# Altium project PowerBoardV2_Logic.PrjPcb
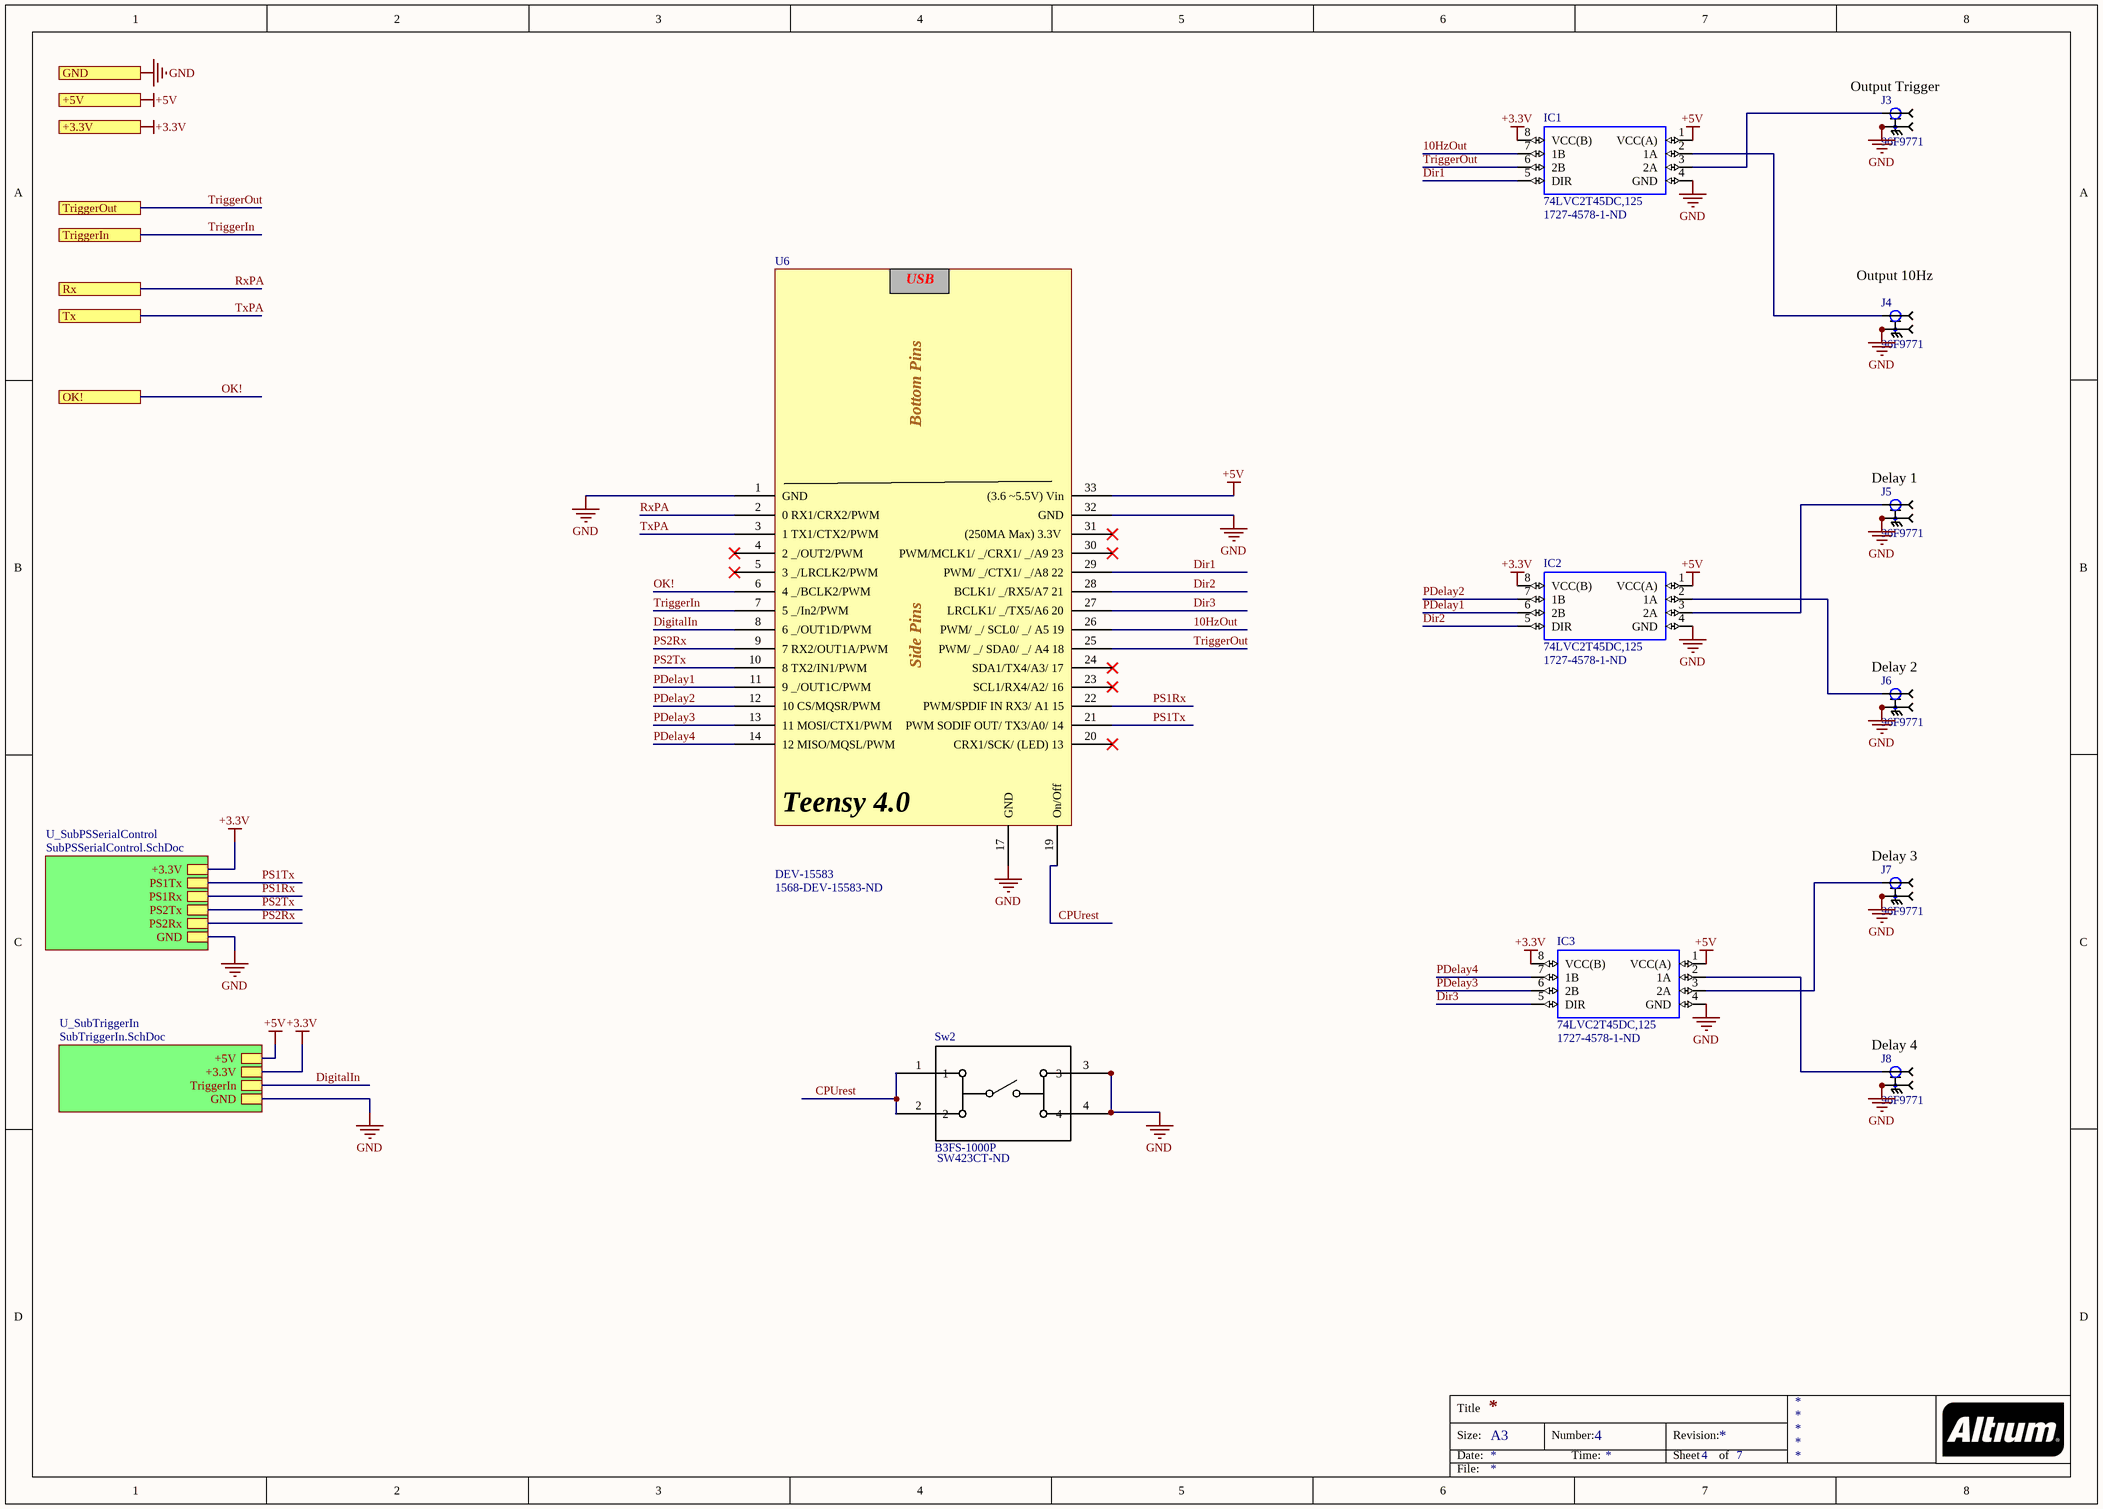
[diagram p0: PAsignal Genrator.SchDoc]
4 sheets, 112 parts. Net scope: hierarchical (ports join the sheet entries above them; power ports are global).
Board file: PCUgen2.PcbDoc
Sheets:
  PAsignal Genrator.SchDoc
    U_SubPSSerialControl = SubPSSerialControl.SchDoc
  SubCardConnect.SchDoc
  SubSchHVCotrol.SchDoc

## Sheet PAsignal Genrator.SchDoc
size A3; DocumentNumber: 4; SheetNumber: 4; SheetTotal: 7

### Parts
IC1  74LVC2T45DC,125  Supplier Part Number 1: 1727-4578-1-ND  [SOP50P310X100-8N]
IC2  74LVC2T45DC,125  Supplier Part Number 1: 1727-4578-1-ND  [SOP50P310X100-8N]
IC3  74LVC2T45DC,125  Supplier Part Number 1: 1727-4578-1-ND  [SOP50P310X100-8N]
J3  Supplier Part Number 1: 96F9771  [SMBboardEdge]  (hidden comment: 131-3701-801)
J4  Supplier Part Number 1: 96F9771  [SMBboardEdge]  (hidden comment: 131-3701-801)
J5  Supplier Part Number 1: 96F9771  [SMBboardEdge]  (hidden comment: 131-3701-801)
J6  Supplier Part Number 1: 96F9771  [SMBboardEdge]  (hidden comment: 131-3701-801)
J7  Supplier Part Number 1: 96F9771  [SMBboardEdge]  (hidden comment: 131-3701-801)
J8  Supplier Part Number 1: 96F9771  [SMBboardEdge]  (hidden comment: 131-3701-801)
Sw2  B3FS-1000P  Supplier Part Number 1: SW423CT-ND  [B3FS-1000P]
U6  DEV-15583  Supplier Part Number 1: 1568-DEV-15583-ND  [Teensy 4.0sideOnly]

### Sub-sheets
U_SubPSSerialControl = SubPSSerialControl.SchDoc: +3.3V, PS1Tx, PS1Rx, PS2Tx, PS2Rx, GND
U_SubTriggerIn = SubTriggerIn.SchDoc (file not in this document): +5V, GND, +3.3V, TriggerIn

### Ports
+3.3V, +5V, GND, OK!, Rx, TriggerIn, TriggerOut, Tx

### Nets
+3.3V: IC1.8(VCC(B)) IC2.8(VCC(B)) IC3.8(VCC(B)) ; port +3.3V, sheet U_SubPSSerialControl/+3.3V, sheet U_SubTriggerIn/+3.3V
+5V: IC1.1(VCC(A)) IC2.1(VCC(A)) IC3.1(VCC(A)) U6.33((3.6_~5.5V)_Vin) ; port +5V, sheet U_SubTriggerIn/+5V
GND: IC1.4(GND) IC2.4(GND) IC3.4(GND) J3.SH1 J3.SH2 J3.SH3 J3.SH4 J4.SH1 J4.SH2 J4.SH3 J4.SH4 J5.SH1 J5.SH2 J5.SH3 J5.SH4 J6.SH1 J6.SH2 J6.SH3 J6.SH4 J7.SH1 J7.SH2 J7.SH3 J7.SH4 J8.SH1 J8.SH2 J8.SH3 J8.SH4 Sw2.3 Sw2.4 U6.1(GND) U6.17(GND) U6.32(GND) ; port GND, sheet U_SubPSSerialControl/GND, sheet U_SubTriggerIn/GND
10HzOut: IC1.7(1B) U6.26(PWM/__/_SCL0/__/_A5_19)
CPUrest: Sw2.1 Sw2.2 U6.19(On/Off)
DigitalIn: U6.8(6__/OUT1D/PWM) ; sheet U_SubTriggerIn/TriggerIn
Dir1: IC1.5(DIR) U6.29(PWM/__/CTX1/__/A8_22)
Dir2: IC2.5(DIR) U6.28(BCLK1/__/RX5/A7_21)
Dir3: IC3.5(DIR) U6.27(LRCLK1/__/TX5/A6_20)
OK!: U6.6(4__/BCLK2/PWM) ; port OK!
PDelay1: IC2.6(2B) U6.11(9__/OUT1C/PWM)
PDelay2: IC2.7(1B) U6.12(10_CS/MQSR/PWM)
PDelay3: IC3.6(2B) U6.13(11_MOSI/CTX1/PWM)
PDelay4: IC3.7(1B) U6.14(12_MISO/MQSL/PWM)
PS1Rx: U6.22(PWM/SPDIF_IN_RX3/_A1_15) ; sheet U_SubPSSerialControl/PS1Rx
PS1Tx: U6.21(PWM_SODIF_OUT/_TX3/A0/_14) ; sheet U_SubPSSerialControl/PS1Tx
PS2Rx: U6.9(7_RX2/OUT1A/PWM) ; sheet U_SubPSSerialControl/PS2Rx
PS2Tx: U6.10(8_TX2/IN1/PWM) ; sheet U_SubPSSerialControl/PS2Tx
RxPA: U6.2(0_RX1/CRX2/PWM) ; port Rx
TriggerIn: U6.7(5__/In2/PWM) ; port TriggerIn
TriggerOut: IC1.6(2B) U6.25(PWM/__/_SDA0/__/_A4_18) ; port TriggerOut
TxPA: U6.3(1_TX1/CTX2/PWM) ; port Tx
NetIC1_2: IC1.2(1A) J4.1
NetIC1_3: IC1.3(2A) J3.1
NetIC2_2: IC2.2(1A) J6.1
NetIC2_3: IC2.3(2A) J5.1
NetIC3_2: IC3.2(1A) J8.1
NetIC3_3: IC3.3(2A) J7.1

Not connected (* = marked no-connect by the designer): U6 4(2__/OUT2/PWM)* 5(3__/LRCLK2/PWM)* 20(CRX1/SCK/_(LED)_13)* 23(SCL1/RX4/A2/_16)* 24(SDA1/TX4/A3/_17)* 30(PWM/MCLK1/__/CRX1/__/A9_23)* 31((250MA_Max)_3.3V_)*

### Notes on the sheet
- (near J3) Output Trigger
- (near J4) Output 10Hz
- (near J5) Delay 1
- (near J6) Delay 2
- (near J7) Delay 3
- (near J8) Delay 4
- Title
- Size:
- Date:
- A3
- Number:
- Time:
- Revision:
- Sheet
- of
- File:
- (in symbol Teensy 4.0_SideOnly) USB; Bottom Pins; Side Pins; Teensy 4.0

### Library data of the parts
IC1-IC3 = 74LVC2T45DC,125: Voltage Level Translator Bidirectional 1 Circuit 2 Channel 420Mbps 8-VSSOP; MF: Nexperia USA; MP: 74LVC2T45DC,125; Value: *; Availability: Good; Package: VSSOP8-8 Nexperia USA Inc.; Check_prices: https://www.snapeda.com/parts/74LVC2T45DC,125/Nexperia/view-part/287401/?ref=eda; Price: None; SnapEDA_Link: https://www.snapeda.com/parts/74LVC2T45DC,125/Nexperia/view-part/287401/?ref=snap; Purchase-URL: https://pricing.snapeda.com/search/part/74LVC2T45DC,125/?ref=eda; Supplier 1: Digi-Key
J3-J8 = SMB: SMB Connector Jack, Male Pin 50Ohm Board Edge, End Launch Solder; Supplier 1: Newark
Sw2 = B3FS-1000P: Tactile Switch SPST-NO Top Actuated Surface Mount; Supplier 1: Digi-Key
U6 = Teensy 4.0_SideOnly: Supplier 1: Digi-Key

## Sheet SubPSSerialControl.SchDoc
size A4; DocumentNumber: 2; SheetNumber: 2; SheetTotal: 7
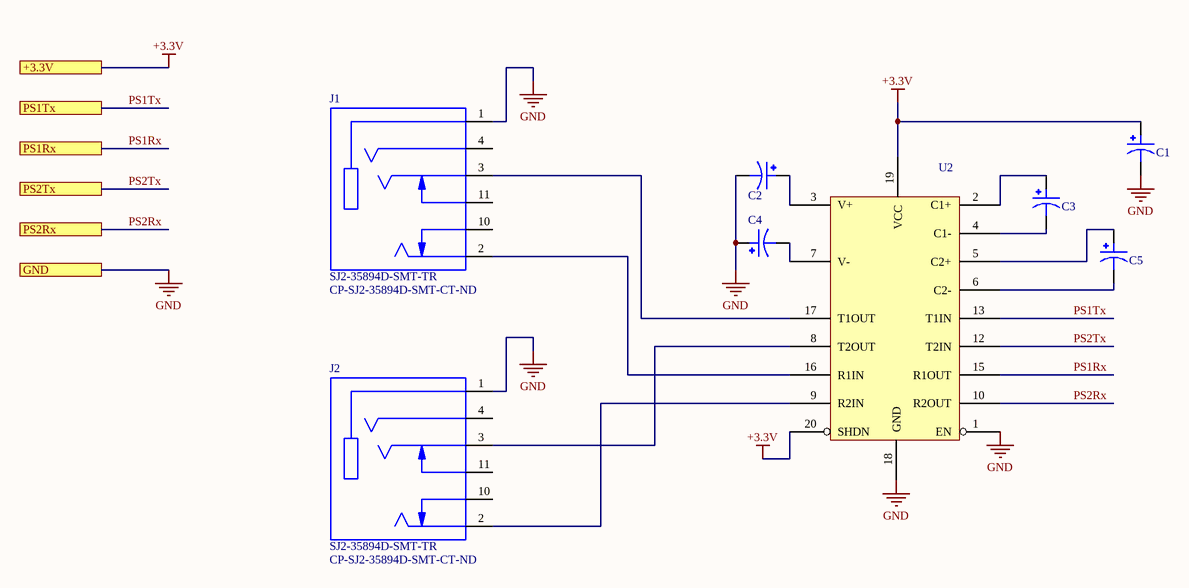
[diagram p1: SubPSSerialControl.SchDoc]

### Parts
C1  T491A104K050AT  [C1206]  (value not drawn)
C2  T491A104K050AT  [C1206]  (value not drawn)
C3  T491A104K050AT  [C1206]  (value not drawn)
C4  T491A104K050AT  [C1206]  (value not drawn)
C5  T491A104K050AT  [C1206]  (value not drawn)
J1  SJ2-35894D-SMT-TR  Supplier Part Number 1: CP-SJ2-35894D-SMT-CT-ND  [CUI_SJ2-35894D-SMT-TR]
J2  SJ2-35894D-SMT-TR  Supplier Part Number 1: CP-SJ2-35894D-SMT-CT-ND  [CUI_SJ2-35894D-SMT-TR]
U2  SP3222ECY-L/TR  [20-TSSOP]  (value not drawn)

### Ports
+3.3V, GND, PS1Rx, PS1Tx, PS2Rx, PS2Tx

### Nets
+3.3V: C1.1(POS) U2.19(VCC) U2.20(SHDN) ; port +3.3V
GND: C1.2(NEG) C2.2(NEG) C4.1(POS) J1.1(SLEEVE) J2.1(SLEEVE) U2.1(EN) U2.18(GND) ; port GND
PS1Rx: U2.15(R1OUT) ; port PS1Rx
PS1Tx: U2.13(T1IN) ; port PS1Tx
PS2Rx: U2.10(R2OUT) ; port PS2Rx
PS2Tx: U2.12(T2IN) ; port PS2Tx
NetC2_1: C2.1(POS) U2.3(V+)
NetC3_1: C3.1(POS) U2.2(C1+)
NetC3_2: C3.2(NEG) U2.4(C1-)
NetC4_2: C4.2(NEG) U2.7(V-)
NetC5_1: C5.1(POS) U2.5(C2+)
NetC5_2: C5.2(NEG) U2.6(C2-)
NetJ1_2: J1.2(TIP) U2.16(R1IN)
NetJ1_3: J1.3(RING1) U2.17(T1OUT)
NetJ2_2: J2.2(TIP) U2.9(R2IN)
NetJ2_3: J2.3(RING1) U2.8(T2OUT)

Not connected (* = marked no-connect by the designer): J1 4(RING2) 10(TIP_SWITCH) 11(RING1_SWITCH); J2 4(RING2) 10(TIP_SWITCH) 11(RING1_SWITCH)

### Notes on the sheet
- Title
- Size:
- Date:
- A4
- Number:
- Time:
- Revision:
- Sheet
- of
- File:

### Library data of the parts
C1-C5 = Cap_1206: Tantalium; Supplier 1: Digi-Key; Supplier Part Number 1: 399-8263-1-ND
J1 J2 = SJ2-35894D-SMT-TR: 3.5 mm, Stereo, Right Angle, Surface Mount _SMT_, Audio Jack Connector; MF: CUI Devices; Value: *; SnapEDA_Link: https://www.snapeda.com/parts/SJ2-35894D-SMT-TR/CUI%20Devices/view-part/1317816/?ref=snap; Package: None; MP: SJ2-35894D-SMT-TR; CUI_purchase_URL: https://www.cuidevices.com/product/interconnect/connectors/audio-connectors/jacks/sj2-3589x-smt-series?utm_source=snapeda.com&utm_medium=referral&utm_campaign=snapedaBOM; Availability: Unavailable; Price: None; Supplier 1: Digi-Key
U2 = SP3222e: The SP3222E and SP3232E series are RS-232 transceiver solutions / intended for portable or hand-held applications such as notebook / or palmtop computers.; Supplier 1: Digi-Key; Supplier Part Number 1: 1016-1792-2-ND

## Sheet SubCardConnect.SchDoc
size A3; DocumentNumber: 5; SheetNumber: 5; SheetTotal: 7
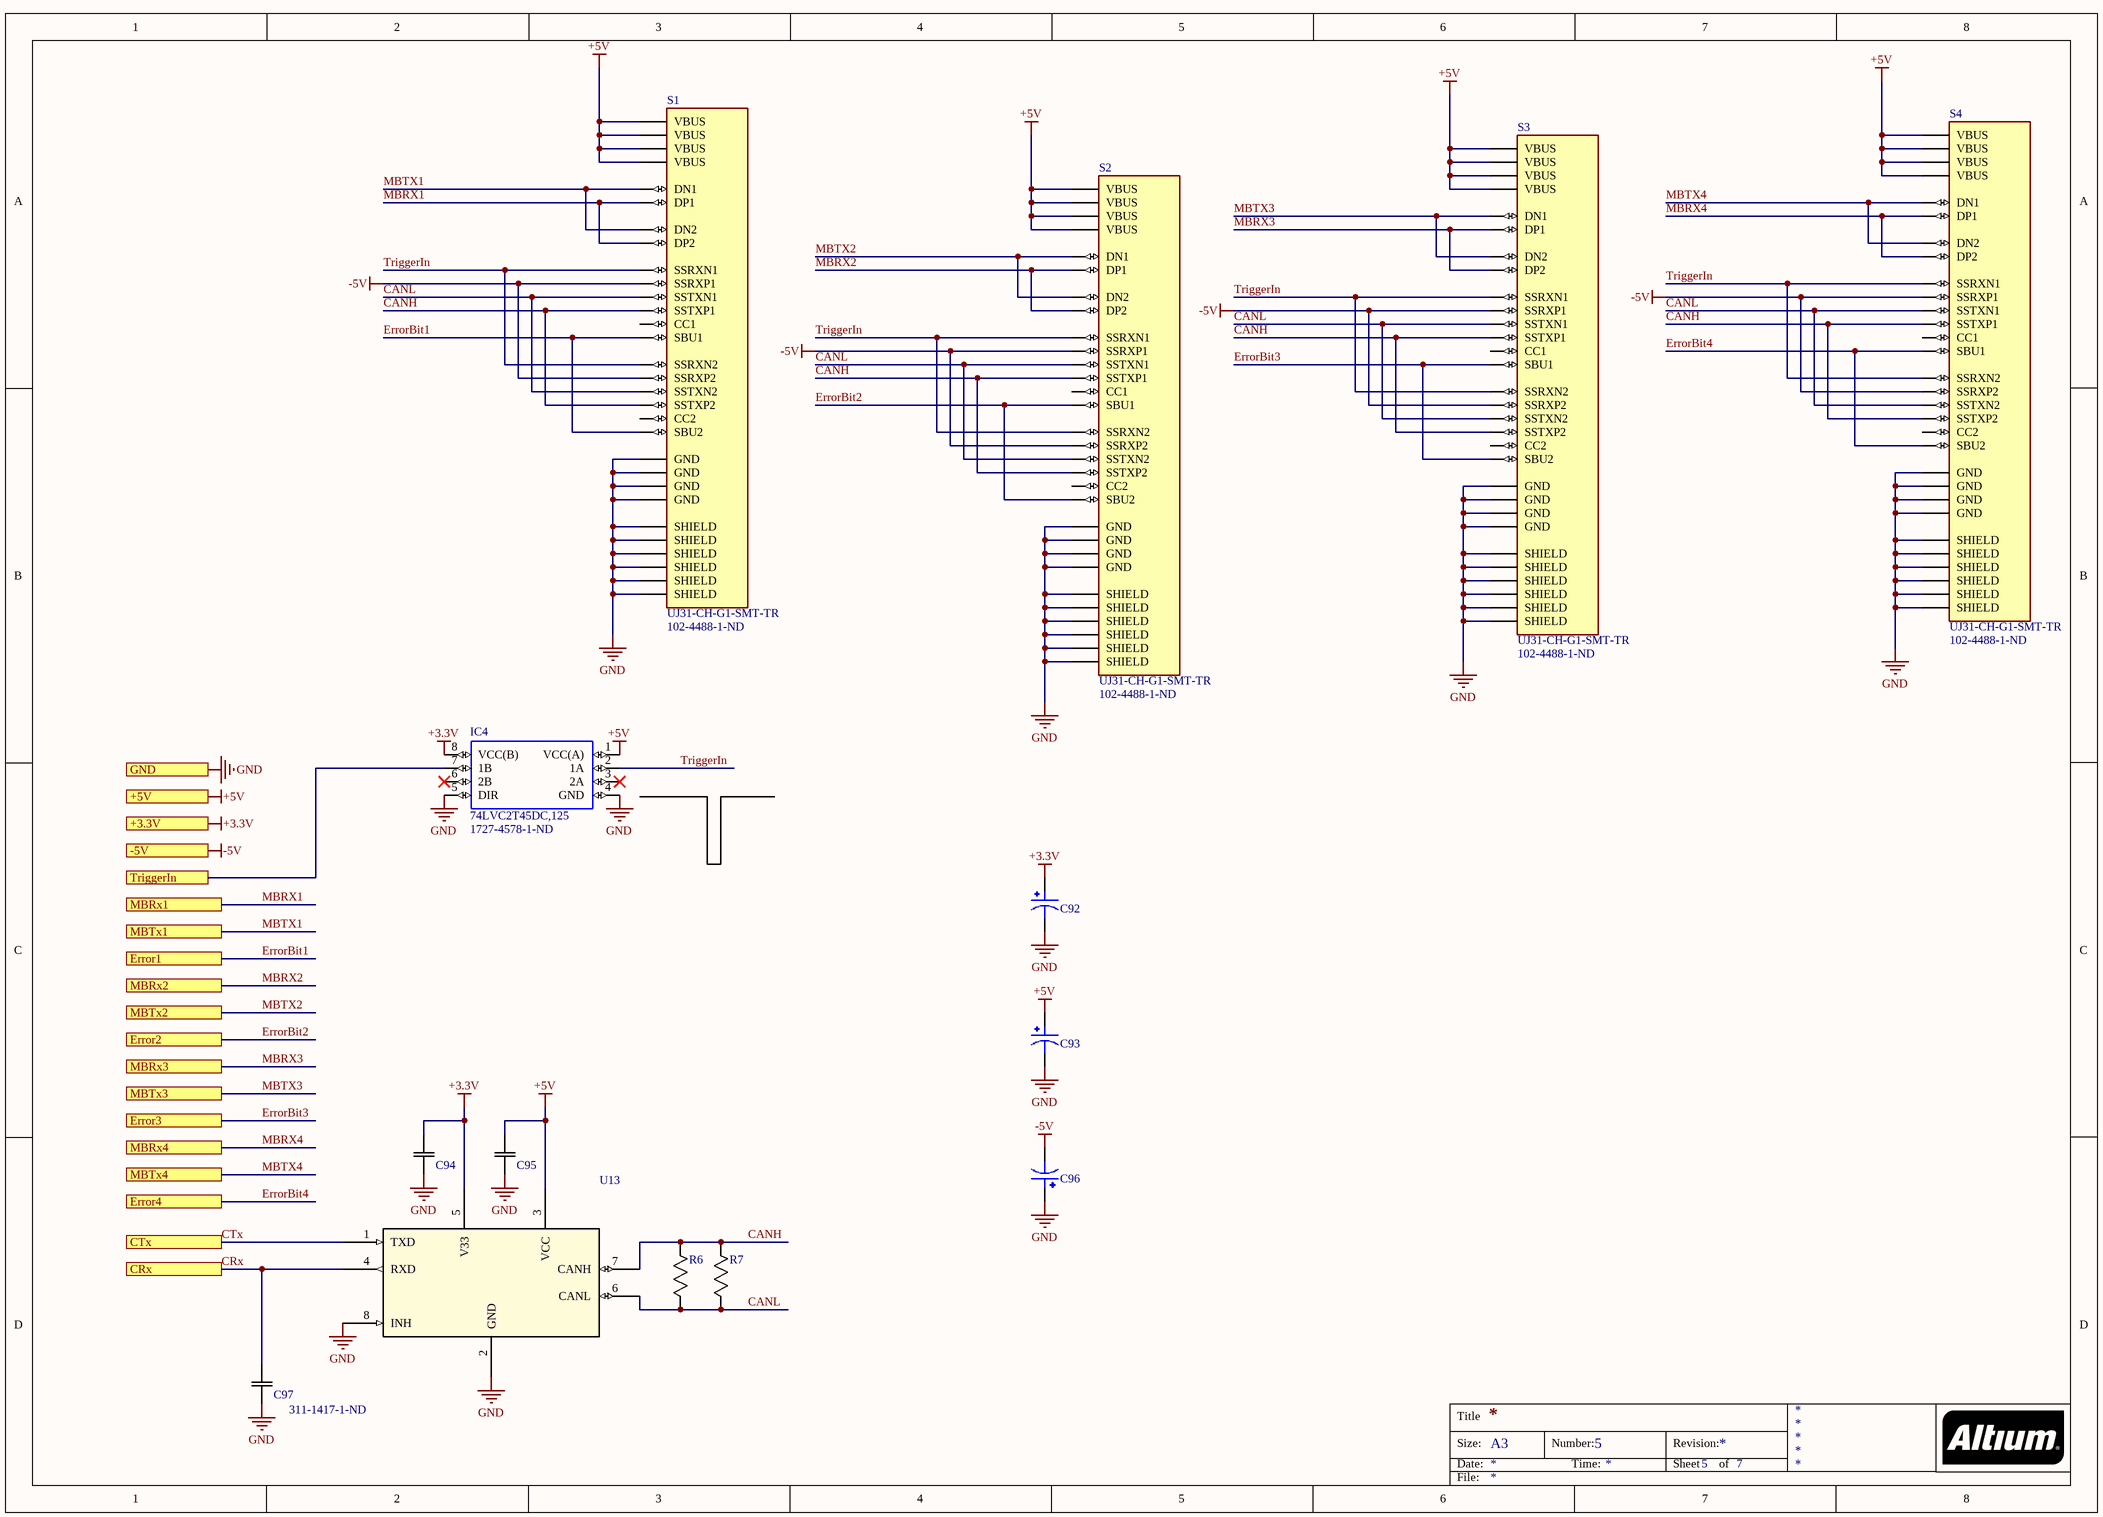
[diagram p2: SubCardConnect.SchDoc]

### Parts
C92  T55A107M6R3C0200  [C1206]  (value not drawn)
C93  T55A107M6R3C0200  [C1206]  (value not drawn)
C94  GRM155R71C103MA01D  [C0402]  (value not drawn)
C95  GRM155R71C103MA01D  [C0402]  (value not drawn)
C96  T55A107M6R3C0200  [C1206]  (value not drawn)
C97  Supplier Part Number 1: 311-1417-1-ND  [C0402]  (hidden comment: CC0402JRNPO9BN200)
IC4  74LVC2T45DC,125  Supplier Part Number 1: 1727-4578-1-ND  [SOP50P310X100-8N]
R6  CRGCQ0805F120R  [0805]  (value not drawn)
R7  CRGCQ0805F120R  [0805]  (value not drawn)
S1  UJ31-CH-G1-SMT-TR  Supplier Part Number 1: 102-4488-1-ND  [CUI_UJ31-CH-G1-SMT-TR]
S2  UJ31-CH-G1-SMT-TR  Supplier Part Number 1: 102-4488-1-ND  [CUI_UJ31-CH-G1-SMT-TR]
S3  UJ31-CH-G1-SMT-TR  Supplier Part Number 1: 102-4488-1-ND  [CUI_UJ31-CH-G1-SMT-TR]
S4  UJ31-CH-G1-SMT-TR  Supplier Part Number 1: 102-4488-1-ND  [CUI_UJ31-CH-G1-SMT-TR]
U13  IFX1050GVIOXUMA1  [SOIC127P600X175-8N]  (value not drawn)

### Ports
+3.3V, +5V, -5V, CRx, CTx, Error1, Error2, Error3, Error4, GND, MBRx1, MBRx2, MBRx3, MBRx4, MBTx1, MBTx2, MBTx3, MBTx4, TriggerIn

### Nets
+3.3V: C92.1(POS) C94.2 IC4.8(VCC(B)) U13.5(V33) ; port +3.3V
+5V: C93.1(POS) C95.2 IC4.1(VCC(A)) S1.A4(VBUS) S1.A9(VBUS) S1.B4(VBUS) S1.B9(VBUS) S2.A4(VBUS) S2.A9(VBUS) S2.B4(VBUS) S2.B9(VBUS) S3.A4(VBUS) S3.A9(VBUS) S3.B4(VBUS) S3.B9(VBUS) S4.A4(VBUS) S4.A9(VBUS) S4.B4(VBUS) S4.B9(VBUS) U13.3(VCC) ; port +5V
-5V: C96.2(NEG) S1.A11(SSRXP2) S1.B11(SSRXP1) S2.A11(SSRXP2) S2.B11(SSRXP1) S3.A11(SSRXP2) S3.B11(SSRXP1) S4.A11(SSRXP2) S4.B11(SSRXP1) ; port -5V
GND: C92.2(NEG) C93.2(NEG) C94.1 C95.1 C96.1(POS) C97.1 IC4.4(GND) IC4.5(DIR) S1.A1(GND) S1.A12(GND) S1.B1(GND) S1.B12(GND) S1.SH1(SHIELD) S1.SH2(SHIELD) S1.SH3(SHIELD) S1.SH4(SHIELD) S1.SH5(SHIELD) S1.SH6(SHIELD) S2.A1(GND) S2.A12(GND) S2.B1(GND) S2.B12(GND) S2.SH1(SHIELD) S2.SH2(SHIELD) S2.SH3(SHIELD) S2.SH4(SHIELD) S2.SH5(SHIELD) S2.SH6(SHIELD) S3.A1(GND) S3.A12(GND) S3.B1(GND) S3.B12(GND) S3.SH1(SHIELD) S3.SH2(SHIELD) S3.SH3(SHIELD) S3.SH4(SHIELD) S3.SH5(SHIELD) S3.SH6(SHIELD) S4.A1(GND) S4.A12(GND) S4.B1(GND) S4.B12(GND) S4.SH1(SHIELD) S4.SH2(SHIELD) S4.SH3(SHIELD) S4.SH4(SHIELD) S4.SH5(SHIELD) S4.SH6(SHIELD) U13.2(GND) U13.8(INH) ; port GND
CANH: R6.2 R7.2 S1.A2(SSTXP1) S1.B2(SSTXP2) S2.A2(SSTXP1) S2.B2(SSTXP2) S3.A2(SSTXP1) S3.B2(SSTXP2) S4.A2(SSTXP1) S4.B2(SSTXP2) U13.7(CANH)
CANL: R6.1 R7.1 S1.A3(SSTXN1) S1.B3(SSTXN2) S2.A3(SSTXN1) S2.B3(SSTXN2) S3.A3(SSTXN1) S3.B3(SSTXN2) S4.A3(SSTXN1) S4.B3(SSTXN2) U13.6(CANL)
CRx: C97.2 U13.4(RXD) ; port CRx
CTx: U13.1(TXD) ; port CTx
ErrorBit1: S1.A8(SBU1) S1.B8(SBU2) ; port Error1
ErrorBit2: S2.A8(SBU1) S2.B8(SBU2) ; port Error2
ErrorBit3: S3.A8(SBU1) S3.B8(SBU2) ; port Error3
ErrorBit4: S4.A8(SBU1) S4.B8(SBU2) ; port Error4
MBRX1: S1.A6(DP1) S1.B6(DP2) ; port MBRx1
MBRX2: S2.A6(DP1) S2.B6(DP2) ; port MBRx2
MBRX3: S3.A6(DP1) S3.B6(DP2) ; port MBRx3
MBRX4: S4.A6(DP1) S4.B6(DP2) ; port MBRx4
MBTX1: S1.A7(DN1) S1.B7(DN2) ; port MBTx1
MBTX2: S2.A7(DN1) S2.B7(DN2) ; port MBTx2
MBTX3: S3.A7(DN1) S3.B7(DN2) ; port MBTx3
MBTX4: S4.A7(DN1) S4.B7(DN2) ; port MBTx4
TriggerIn: IC4.2(1A) S1.A10(SSRXN2) S1.B10(SSRXN1) S2.A10(SSRXN2) S2.B10(SSRXN1) S3.A10(SSRXN2) S3.B10(SSRXN1) S4.A10(SSRXN2) S4.B10(SSRXN1)
NetIC4_7: IC4.7(1B) ; port TriggerIn

Not connected (* = marked no-connect by the designer): IC4 3(2A)* 6(2B)*; S1 A5(CC1) B5(CC2); S2 A5(CC1) B5(CC2); S3 A5(CC1) B5(CC2); S4 A5(CC1) B5(CC2)

### Notes on the sheet
- Title
- Size:
- Date:
- A3
- Number:
- Time:
- Revision:
- Sheet
- of
- File:

### Library data of the parts
C92 C93 C96 = Cap_1206: Tantalium; Supplier 1: Mouser; Supplier Part Number 1: 74-T55A107M6R3C0200
C94 C95 C97 = Cap_0402: Supplier 1: Digi-Key
  C94 C95: Supplier Part Number 1: 490-16353-1-ND
IC4 = 74LVC2T45DC,125: as IC1 on sheet PAsignal Genrator; MP: 74LVC2T45DC,125; Value: *; Availability: Good; Package: VSSOP8-8 Nexperia USA Inc.; Check_prices: https://www.snapeda.com/parts/74LVC2T45DC,125/Nexperia/view-part/287401/?ref=eda; Price: None; SnapEDA_Link: https://www.snapeda.com/parts/74LVC2T45DC,125/Nexperia/view-part/287401/?ref=snap; Purchase-URL: https://pricing.snapeda.com/search/part/74LVC2T45DC,125/?ref=eda; Supplier 1: Digi-Key
R6 R7 = Res_0805: Supplier 1: Digi-Key; Supplier Part Number 1: A129738CT-ND
S1-S4 = UJ31-CH-G1-SMT-TR: Type C, USB 3.1 Gen 2, 5 A, Right Angle, Surface Mount _SMT_ , USB Receptacle; MF: CUI Devices; CUI_purchase_URL: https://www.cuidevices.com/product/interconnect/connectors/usb-connectors/uj31-ch-g1-smt-tr?utm_source=snapeda.com&utm_medium=referral&utm_campaign=snapedaBOM; Price: None; SnapEDA_Link: https://www.snapeda.com/parts/UJ31-CH-G1-SMT-TR/CUI%20Devices/view-part/2754415/?ref=snap; Package: None; Availability: Unavailable; Value: *; MP: UJ31-CH-G1-SMT-TR; Supplier 1: Digi-Key
U13 = IFX1050GVIOXUMA1: No Description Available; Vendor: Infineon; Built_By: EMA_UL_Team; SourceLibrary: Infineon_2014-07-30; Manufacturer_Part_Number: IFX1050G; Copyright: Copyright (C) 2018 Accelerated Designs. All rights reserved; RefDes: RefDes; Type: DEV; Supplier 1: Digi-Key; Supplier Part Number 1: IFX1050GVIOXUMA1CT-ND

## Sheet SubSchHVCotrol.SchDoc: High Voltage handling and monitoring
size A3; DocumentNumber: 6; SheetNumber: 6; SheetTotal: 7
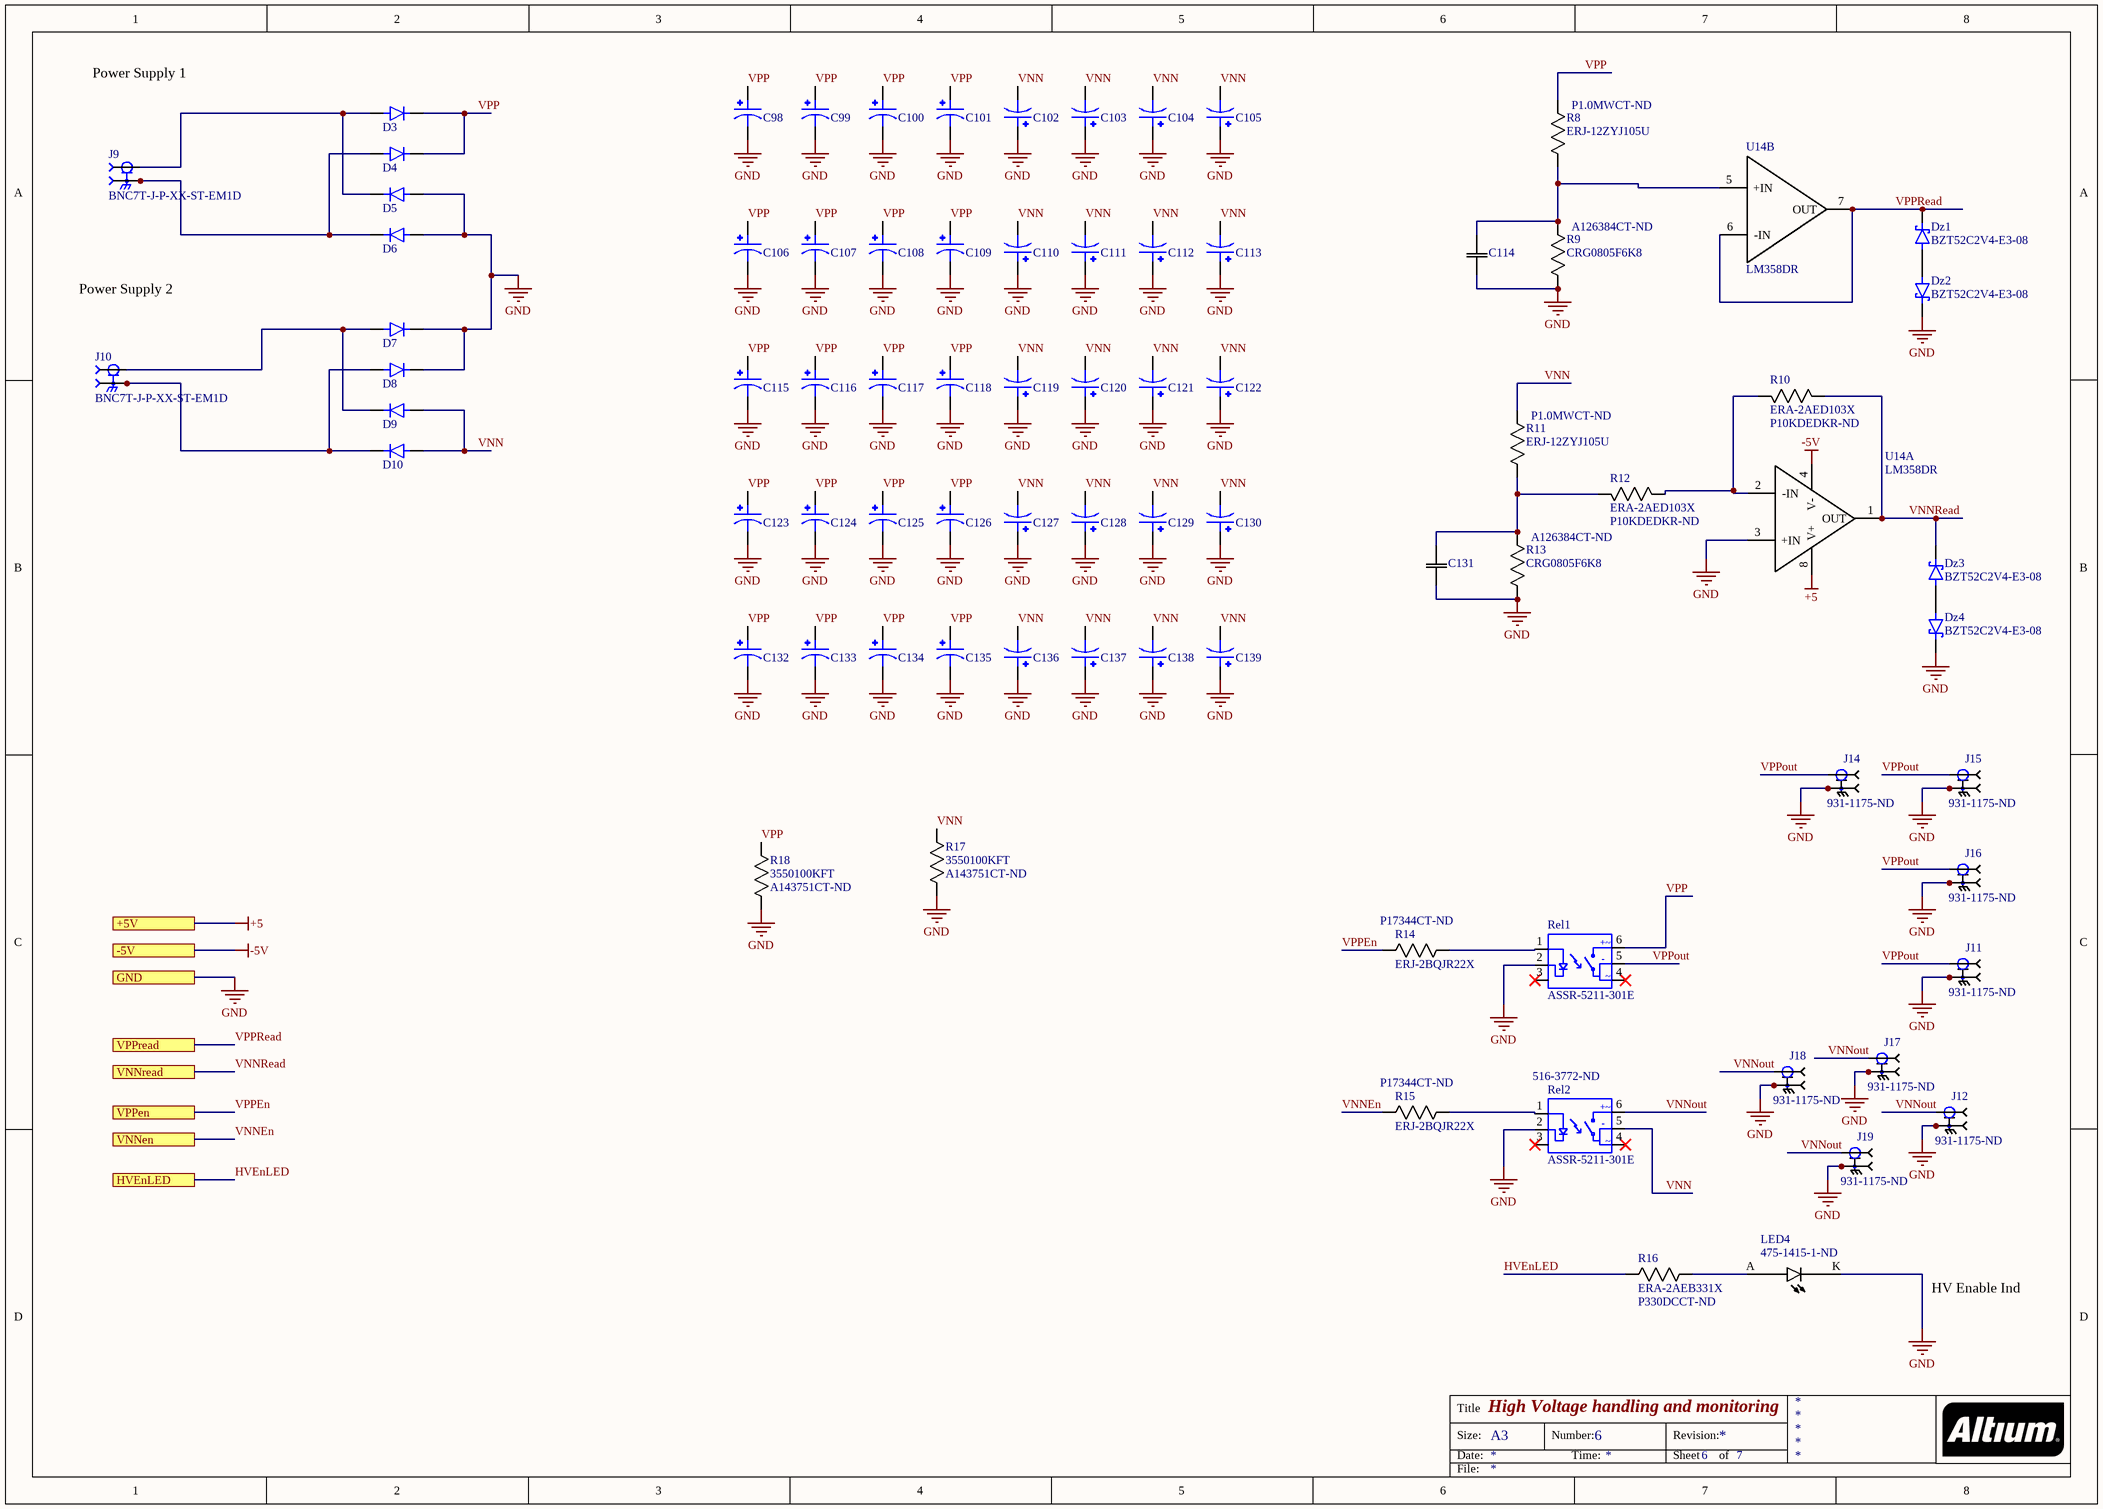
[diagram p3: SubSchHVCotrol.SchDoc]

### Parts
C98  EDH336M400A9TAA  [CAPAE1700X1700N]  (value not drawn)
C99  EDH336M400A9TAA  [CAPAE1700X1700N]  (value not drawn)
C100  EDH336M400A9TAA  [CAPAE1700X1700N]  (value not drawn)
C101  EDH336M400A9TAA  [CAPAE1700X1700N]  (value not drawn)
C102  EDH336M400A9TAA  [CAPAE1700X1700N]  (value not drawn)
C103  EDH336M400A9TAA  [CAPAE1700X1700N]  (value not drawn)
C104  EDH336M400A9TAA  [CAPAE1700X1700N]  (value not drawn)
C105  EDH336M400A9TAA  [CAPAE1700X1700N]  (value not drawn)
C106  EDH336M400A9TAA  [CAPAE1700X1700N]  (value not drawn)
C107  EDH336M400A9TAA  [CAPAE1700X1700N]  (value not drawn)
C108  EDH336M400A9TAA  [CAPAE1700X1700N]  (value not drawn)
C109  EDH336M400A9TAA  [CAPAE1700X1700N]  (value not drawn)
C110  EDH336M400A9TAA  [CAPAE1700X1700N]  (value not drawn)
C111  EDH336M400A9TAA  [CAPAE1700X1700N]  (value not drawn)
C112  EDH336M400A9TAA  [CAPAE1700X1700N]  (value not drawn)
C113  EDH336M400A9TAA  [CAPAE1700X1700N]  (value not drawn)
C114  C0805C104Z5VACTU  [C0805]  (value not drawn)
C115  EDH336M400A9TAA  [CAPAE1700X1700N]  (value not drawn)
C116  EDH336M400A9TAA  [CAPAE1700X1700N]  (value not drawn)
C117  EDH336M400A9TAA  [CAPAE1700X1700N]  (value not drawn)
C118  EDH336M400A9TAA  [CAPAE1700X1700N]  (value not drawn)
C119  EDH336M400A9TAA  [CAPAE1700X1700N]  (value not drawn)
C120  EDH336M400A9TAA  [CAPAE1700X1700N]  (value not drawn)
C121  EDH336M400A9TAA  [CAPAE1700X1700N]  (value not drawn)
C122  EDH336M400A9TAA  [CAPAE1700X1700N]  (value not drawn)
C123  EDH336M400A9TAA  [CAPAE1700X1700N]  (value not drawn)
C124  EDH336M400A9TAA  [CAPAE1700X1700N]  (value not drawn)
C125  EDH336M400A9TAA  [CAPAE1700X1700N]  (value not drawn)
C126  EDH336M400A9TAA  [CAPAE1700X1700N]  (value not drawn)
C127  EDH336M400A9TAA  [CAPAE1700X1700N]  (value not drawn)
C128  EDH336M400A9TAA  [CAPAE1700X1700N]  (value not drawn)
C129  EDH336M400A9TAA  [CAPAE1700X1700N]  (value not drawn)
C130  EDH336M400A9TAA  [CAPAE1700X1700N]  (value not drawn)
C131  C0805C104Z5VACTU  [C0805]  (value not drawn)
C132  EDH336M400A9TAA  [CAPAE1700X1700N]  (value not drawn)
C133  EDH336M400A9TAA  [CAPAE1700X1700N]  (value not drawn)
C134  EDH336M400A9TAA  [CAPAE1700X1700N]  (value not drawn)
C135  EDH336M400A9TAA  [CAPAE1700X1700N]  (value not drawn)
C136  EDH336M400A9TAA  [CAPAE1700X1700N]  (value not drawn)
C137  EDH336M400A9TAA  [CAPAE1700X1700N]  (value not drawn)
C138  EDH336M400A9TAA  [CAPAE1700X1700N]  (value not drawn)
C139  EDH336M400A9TAA  [CAPAE1700X1700N]  (value not drawn)
D3  CD1408-R11000  [CD1408]  (value not drawn)
D4  CD1408-R11000  [CD1408]  (value not drawn)
D5  CD1408-R11000  [CD1408]  (value not drawn)
D6  CD1408-R11000  [CD1408]  (value not drawn)
D7  CD1408-R11000  [CD1408]  (value not drawn)
D8  CD1408-R11000  [CD1408]  (value not drawn)
D9  CD1408-R11000  [CD1408]  (value not drawn)
D10  CD1408-R11000  [CD1408]  (value not drawn)
Dz1  BZT52C2V4-E3-08  [SOD-123]
Dz2  BZT52C2V4-E3-08  [SOD-123]
Dz3  BZT52C2V4-E3-08  [SOD-123]
Dz4  BZT52C2V4-E3-08  [SOD-123]
J9  BNC7T-J-P-XX-ST-EM1D  [SAMTEC_BNC7T-J-P-XX-ST-EM1D]
J10  BNC7T-J-P-XX-ST-EM1D  [SAMTEC_BNC7T-J-P-XX-ST-EM1D]
J11  Supplier Part Number 1: 931-1175-ND  [*TAOGLAS_EMPCB.SMAFSTJ.B.HT_EMPCB.SMAFSTJ.B.HT(Primary)]  (hidden comment: EMPCB.SMAFSTJ.B.HT)
J12  Supplier Part Number 1: 931-1175-ND  [*TAOGLAS_EMPCB.SMAFSTJ.B.HT_EMPCB.SMAFSTJ.B.HT(Primary)]  (hidden comment: EMPCB.SMAFSTJ.B.HT)
J14  Supplier Part Number 1: 931-1175-ND  [*TAOGLAS_EMPCB.SMAFSTJ.B.HT_EMPCB.SMAFSTJ.B.HT(Primary)]  (hidden comment: EMPCB.SMAFSTJ.B.HT)
J15  Supplier Part Number 1: 931-1175-ND  [*TAOGLAS_EMPCB.SMAFSTJ.B.HT_EMPCB.SMAFSTJ.B.HT(Primary)]  (hidden comment: EMPCB.SMAFSTJ.B.HT)
J16  Supplier Part Number 1: 931-1175-ND  [*TAOGLAS_EMPCB.SMAFSTJ.B.HT_EMPCB.SMAFSTJ.B.HT(Primary)]  (hidden comment: EMPCB.SMAFSTJ.B.HT)
J17  Supplier Part Number 1: 931-1175-ND  [*TAOGLAS_EMPCB.SMAFSTJ.B.HT_EMPCB.SMAFSTJ.B.HT(Primary)]  (hidden comment: EMPCB.SMAFSTJ.B.HT)
J18  Supplier Part Number 1: 931-1175-ND  [*TAOGLAS_EMPCB.SMAFSTJ.B.HT_EMPCB.SMAFSTJ.B.HT(Primary)]  (hidden comment: EMPCB.SMAFSTJ.B.HT)
J19  Supplier Part Number 1: 931-1175-ND  [*TAOGLAS_EMPCB.SMAFSTJ.B.HT_EMPCB.SMAFSTJ.B.HT(Primary)]  (hidden comment: EMPCB.SMAFSTJ.B.HT)
LED4  Supplier Part Number 1: 475-1415-1-ND  [LEDr0805]  (hidden comment: LH R974-LP-1)
R8  ERJ-12ZYJ105U  Supplier Part Number 1: P1.0MWCT-ND  [R2010]
R9  CRG0805F6K8  Supplier Part Number 1: A126384CT-ND  [0805]
R10  ERA-2AED103X  Supplier Part Number 1: P10KDEDKR-ND  [R0402]
R11  ERJ-12ZYJ105U  Supplier Part Number 1: P1.0MWCT-ND  [R2010]
R12  ERA-2AED103X  Supplier Part Number 1: P10KDEDKR-ND  [R0402]
R13  CRG0805F6K8  Supplier Part Number 1: A126384CT-ND  [0805]
R14  ERJ-2BQJR22X  Supplier Part Number 1: P17344CT-ND  [0402-A]
R15  ERJ-2BQJR22X  Supplier Part Number 1: P17344CT-ND  [0402-A]
R16  ERA-2AEB331X  Supplier Part Number 1: P330DCCT-ND  [0402]
R17  3550100KFT  Supplier Part Number 1: A143751CT-ND  [355047KJT]
R18  3550100KFT  Supplier Part Number 1: A143751CT-ND  [355047KJT]
Rel1  ASSR-5211-301E  [6-DIPGullWing]
Rel2  ASSR-5211-301E  Supplier Part Number 1: 516-3772-ND  [6-DIPGullWing]
U14  LM358DR  [SOIC127P600X175-8N]  (parts A,B of 2)

### Ports
+5V, -5V, GND, HVEnLED, VNNen, VNNread, VPPen, VPPread

### Nets
+5: U14.8(V+) ; port +5V
-5V: U14.4(V-) ; port -5V
GND: C98.2(NEG) C99.2(NEG) C100.2(NEG) C101.2(NEG) C102.1(POS) C103.1(POS) C104.1(POS) C105.1(POS) C106.2(NEG) C107.2(NEG) C108.2(NEG) C109.2(NEG) C110.1(POS) C111.1(POS) C112.1(POS) C113.1(POS) C114.1 C115.2(NEG) C116.2(NEG) C117.2(NEG) C118.2(NEG) C119.1(POS) C120.1(POS) C121.1(POS) C122.1(POS) C123.2(NEG) C124.2(NEG) C125.2(NEG) C126.2(NEG) C127.1(POS) C128.1(POS) C129.1(POS) C130.1(POS) C131.1 C132.2(NEG) C133.2(NEG) C134.2(NEG) C135.2(NEG) C136.1(POS) C137.1(POS) C138.1(POS) C139.1(POS) D5.2 D6.2 D7.1 D8.1 Dz2.1(K) Dz4.1(K) J11.SH1 J11.SH2 J11.SH3 J11.SH4 J12.SH1 J12.SH2 J12.SH3 J12.SH4 J14.SH1 J14.SH2 J14.SH3 J14.SH4 J15.SH1 J15.SH2 J15.SH3 J15.SH4 J16.SH1 J16.SH2 J16.SH3 J16.SH4 J17.SH1 J17.SH2 J17.SH3 J17.SH4 J18.SH1 J18.SH2 J18.SH3 J18.SH4 J19.SH1 J19.SH2 J19.SH3 J19.SH4 LED4.K(k) R9.1 R13.1 R17.1 R18.1 Rel1.2 Rel2.2 U14.3(+IN) ; port GND
HVEnLED: R16.2 ; port HVEnLED
VNN: C102.2(NEG) C103.2(NEG) C104.2(NEG) C105.2(NEG) C110.2(NEG) C111.2(NEG) C112.2(NEG) C113.2(NEG) C119.2(NEG) C120.2(NEG) C121.2(NEG) C122.2(NEG) C127.2(NEG) C128.2(NEG) C129.2(NEG) C130.2(NEG) C136.2(NEG) C137.2(NEG) C138.2(NEG) C139.2(NEG) D9.2 D10.2 R11.2 R17.2 Rel2.5
VNNEn: R15.2 ; port VNNen
VNNout: J12.1 J17.1 J18.1 J19.1 Rel2.6
VNNRead: Dz3.1(K) R10.2 U14.1(OUT) ; port VNNread
VPP: C98.1(POS) C99.1(POS) C100.1(POS) C101.1(POS) C106.1(POS) C107.1(POS) C108.1(POS) C109.1(POS) C115.1(POS) C116.1(POS) C117.1(POS) C118.1(POS) C123.1(POS) C124.1(POS) C125.1(POS) C126.1(POS) C132.1(POS) C133.1(POS) C134.1(POS) C135.1(POS) D3.1 D4.1 R8.2 R18.2 Rel1.6
VPPEn: R14.2 ; port VPPen
VPPout: J11.1 J14.1 J15.1 J16.1 Rel1.5
VPPRead: Dz1.1(K) U14.6(-IN) U14.7(OUT) ; port VPPread
NetC114_2: C114.2 R8.1 R9.2 U14.5(+IN)
NetC131_2: C131.2 R11.1 R12.1 R13.2
NetD3_2: D3.2 D5.1 J9.1
NetD4_2: D4.2 D6.1 J9.S1 J9.S2 J9.S3 J9.S4
NetD7_2: D7.2 D9.1 J10.1
NetD8_2: D8.2 D10.1 J10.S1 J10.S2 J10.S3 J10.S4
NetDz1_2: Dz1.2(A) Dz2.2(A)
NetDz3_2: Dz3.2(A) Dz4.2(A)
NetLED4_A: LED4.A R16.1
NetR10_1: R10.1 R12.2 U14.2(-IN)
NetR14_1: R14.1 Rel1.1
NetR15_1: R15.1 Rel2.1

Not connected (* = marked no-connect by the designer): Rel1 3* 4*; Rel2 3* 4*

### Notes on the sheet
- Power Supply 1
- Power Supply 2
- HV Enable Ind
- Title
- Size:
- Date:
- A3
- Number:
- Time:
- Revision:
- Sheet
- of
- File:
- (in symbol ASSR-5211-301E) +~; -; ~

### Library data of the parts
C98-C113 C115-C130 C132-C139 = EDH336M400A9TAA: 33ÂµF 400V Aluminum Electrolytic Capacitors Radial, Can - SMD 2000 Hrs @ 105Â°C; MF: KEMET; Package: Radial KEMET; Value: *; Price: None; MP: EDH336M400A9TAA; Availability: Unavailable; SnapEDA_Link: https://www.snapeda.com/parts/EDH336M400A9TAA/KEMET/view-part/2337124/?ref=snap
C114 C131 = Cap_0805: Supplier 1: Digi-Key; Supplier Part Number 1: 399-1177-1-ND
D3-D10 = CD1408-R11000: Diode Standard 1000V 1A Surface Mount 1408; Supplier 1: Digi-Key; Supplier Part Number 1: CD1408-R11000CT-ND
Dz1-Dz4 = BZT52C2V4-E3-08: Zener Diode 2.4V 410mW ±5% Surface Mount SOD-123; Supplier 1: Digi-Key; Supplier Part Number 1: 112-BZT52C2V4-E3-08CT-ND
J9 J10 = BNC7T-J-P-XX-ST-EM1D: BNC Connector Jack, Female Socket 75Ohm Board Edge, End Launch; Panel Mount Solder; MP: BNC7T-J-P-GN-ST-EM1D; MF: Samtec Inc.; Package: None; DigiKey-Purchase-URL: https://snapeda.com/shop?store=DigiKey&id=3266999; Price: None; SnapEDA_Link: https://www.snapeda.com/parts/BNC7T-J-P-GN-ST-EM1D/Samtec%20Inc./view-part/3266999/?ref=snap; Toby_UK-Purchase-URL: https://snapeda.com/shop?store=Toby+UK&id=3266999; Value: *; Availability: Unavailable
J11 J12 J14-J19 = EMPCB.SMAFSTJ.B.HT: SMA Connector Jack, Female Socket 50Ohm Board Edge, End Launch Solder; MF: Taoglas Limited; Package: None; Digi-Key_Part_Number: 931-1175-ND; Digi-Key_Purchase_URL: https://www.digikey.com/product-detail/en/taoglas-limited/EMPCB.SMAFSTJ.B.HT/931-1175-ND/3522337?utm_source=snapeda&utm_medium=aggregator&utm_campaign=symbol; MP: EMPCB.SMAFSTJ.B.HT; SnapEDA_Link: https://www.snapeda.com/parts/EMPCB.SMAFSTJ.B.HT/Taoglas%20Limited/view-part/231078/?ref=snap; Value: *; Supplier 1: Digi-Key
LED4 = LED_0805: LED: / LH R974-LP-1 / LG R971-KN-1 / LY R976-PS-36; Supplier 1: Digi-Key
R8 R11 = Res_2010: Chip Resistor 2010 (5025 Metric) Automotive AEC-Q200 Thick Film; Supplier 1: Digi-Key
R9 R10 R12-R16 = Res_0805: Supplier 1: Digi-Key
R17 R18 = Res_3550: 100K 5W; Supplier 1: Digi-Key
Rel1 Rel2 = ASSR-5211-301E: Solid State SPST-NO (1 Form A) 6-SMD (0.300", 7.62mm) / SSR RELAY SPST-NO 200MA 0-600V
  Rel2: Supplier 1: Digi-Key

## Nets that join several sheets
+3.3V: PAsignal Genrator (IC1.8 IC2.8 IC3.8), SubPSSerialControl (C1.1 U2.19 U2.20), SubCardConnect (C92.1 C94.2 IC4.8 U13.5)
+5V: PAsignal Genrator (IC1.1 IC2.1 IC3.1 U6.33), SubCardConnect (20 pins)
-5V: SubCardConnect (9 pins), SubSchHVCotrol (U14.4)
GND: PAsignal Genrator (32 pins), SubPSSerialControl (7 pins), SubCardConnect (50 pins), SubSchHVCotrol (88 pins)
PS1Rx: PAsignal Genrator (U6.22), SubPSSerialControl (U2.15)
PS1Tx: PAsignal Genrator (U6.21), SubPSSerialControl (U2.13)
PS2Rx: PAsignal Genrator (U6.9), SubPSSerialControl (U2.10)
PS2Tx: PAsignal Genrator (U6.10), SubPSSerialControl (U2.12)